# EAGLE board CrowPanel Pico Display-3.5_V1.0-240412 (EAGLE 9.6.2)
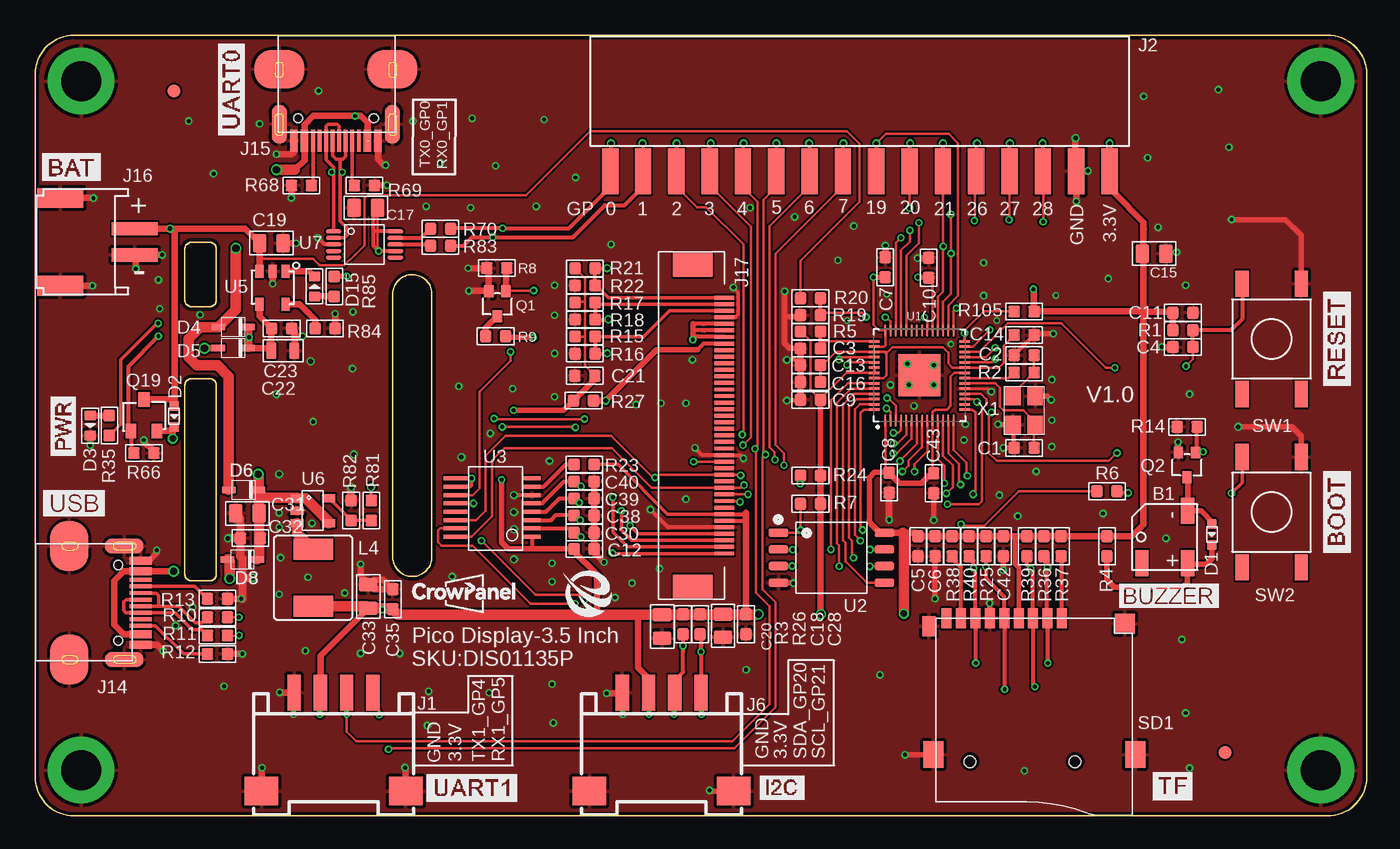
[diagram p5: board, top side]
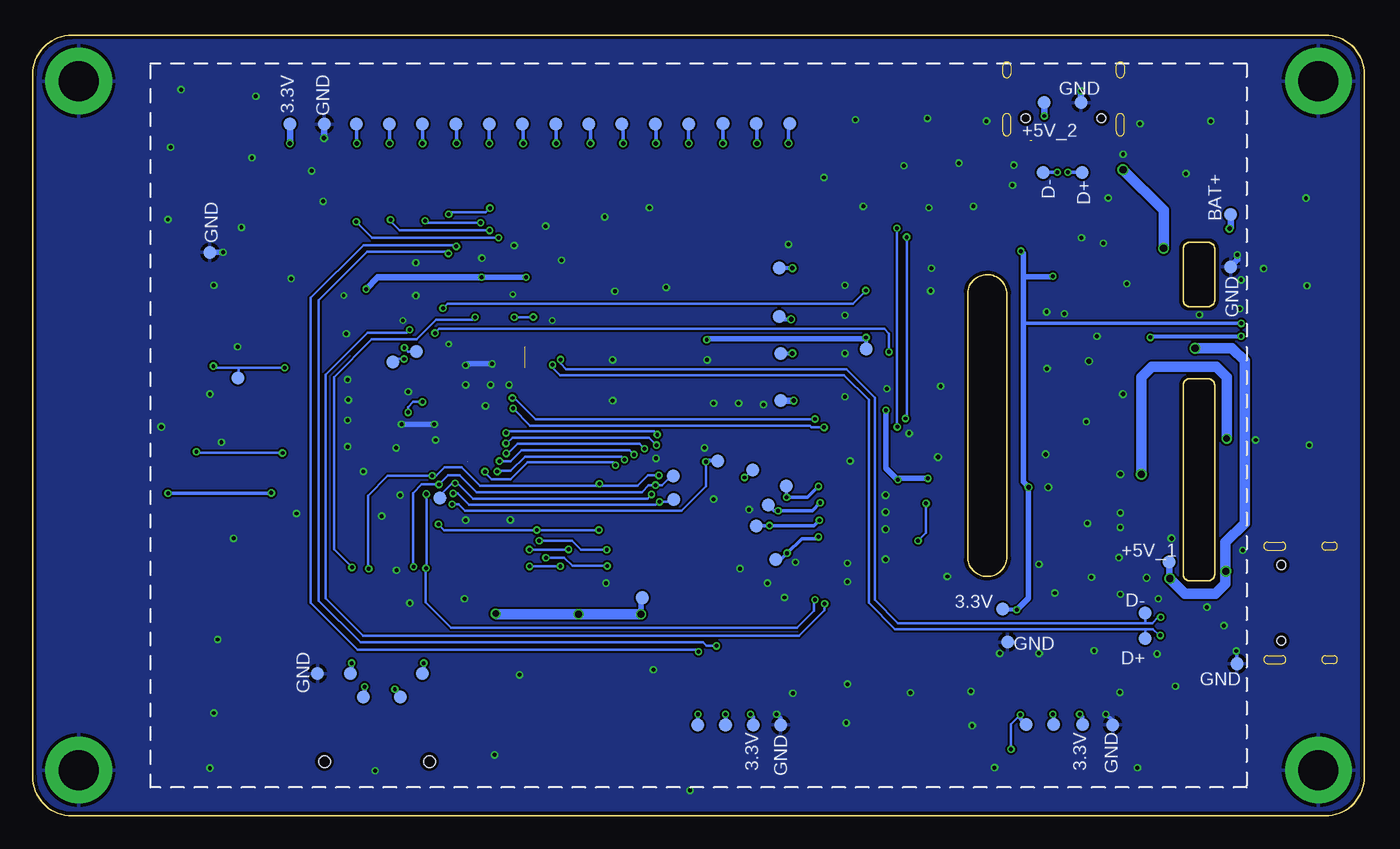
[diagram p6: board, bottom side, seen from below]

Size 101.5 x 59.5 mm. Coordinates in mm from the lower left corner, seen from the top.
Outline: 3,0 98.5,0 arc90 101.5,3 101.5,56.5 arc90 98.5,59.5 3,59.5 arc90 0,56.5 0,3 arc90 3,0
Outline: 11.41,43.21 11.41,39.31 arc90 11.91,38.81 13.31,38.81 arc90 13.81,39.31 13.81,43.21 arc90 13.31,43.71 11.91,43.71 arc90 11.41,43.21
Outline: 11.41,32.82 11.41,18.42 arc90 11.91,17.92 13.31,17.92 arc90 13.81,18.42 13.81,32.82 arc90 13.31,33.32 11.91,33.32 arc90 11.41,32.82
Outline: 27.25,19.75 27.25,39.75 arc-170 30.23,40 30.23,19.5 arc-170 27.25,19.75
Copper layers (1*16): Top 0.035mm / dielectric 1.5mm / Bottom 0.035mm
Design rules "default *": minimum track width 0.2mm, minimum drill 0.3mm, track to track 6mil, track to pad 6mil, pad to pad 6mil, via to via 6mil, smd to smd 6mil, copper to edge 10mil, drill to drill 6mil, minimum pad ring 5mil, minimum via ring 5mil, stop-mask expansion 4mil, vias tented up to drill 100mil, thermal gap 10mil
Net classes: 1 PWR: width 0.254 mm; 2 GND: width 0.203 mm; 3 RS485: width 0.203 mm, clearance 0.203 mm; 4 USB: width 0.203 mm, clearance 0.152 mm; 5 ANT: width 0.889 mm, clearance 0.203 mm

## Footprints (pad centres in the part's own frame; a part is rotated, then mirrored left to right if it is on the bottom)
BEEP_5025 = smd 2 x 1: 1 -2,-1.75; 2 2,-1.75; 3 -2,1.75
A_XBJ_0603 = smd 0.889 x 0.889: 1 -0.762,0; 2 0.762,0
A_XBJ_0805 = smd 1.016 x 1.397: 1 -0.889,0; 2 0.889,0
DISCRETE_C0603 = smd 0.889 x 0.889: 1 -0.762,0; 2 0.762,0
0805_S = smd 0.762 x 1.27: 1 -0.889,0; 2 0.889,0
C0603 = smd 0.889 x 0.889: 1 -0.762,0; 2 0.762,0
0603 = smd 0.889 x 0.889: 1 -0.762,0; 2 0.762,0
SOD-523 = smd 0.762 x 0.7: + -0.8,0; - 0.8,0
DISCRETE_D0603 = smd 0.762 x 0.889: + -0.762,0; - 0.762,0
SOD-323 = smd 1.016 x 0.508: 1 1.137,0; 2 -1.137,0
CONNECTOR_4P-SMD-2.0-90D = smd 1.01 x 2.74: 1 -3,-0.1; 2 -1,-0.1; 3 1,-0.1; 4 3,-0.1 | smd 2.54 x 2.184: SS1 -5.5,7.4; SS2 5.5,7.4
2.54-16P-WOTIE = smd 1.25 x 3.5: 1 -18.999,-5.572; 2 -16.51,-5.572; 3 -13.97,-5.572; 4 -11.43,-5.572; 5 -8.89,-5.572; 6 -6.35,-5.572; 7 -3.81,-5.572; 8 -1.27,-5.572; 9 1.27,-5.572; 10 3.81,-5.572; 11 6.35,-5.572; 12 8.89,-5.572; 13 11.43,-5.572; 14 13.97,-5.572; 15 16.51,-5.572; 16 19.05,-5.572
KEVIN_3.0TYPEC-SMD = smd 0.3 x 1.7: A1 -3.35,0.5; A4 -2.55,0.5; A5 -1.25,0.5; A6 -0.25,0.5; A7 0.25,0.5; A8 1.25,0.5; A9 2.55,0.5; A12 3.35,0.5; B1 3.05,0.5; B4 2.25,0.5; B5 1.75,0.5; B6 0.75,0.5; B7 -0.75,0.5; B8 -1.75,0.5; B9 -2.25,0.5; B12 -3.05,0.5 | smd 1.143 x 2.921: P$6 -4.318,-0.762; P$7 4.318,-0.762 | smd 3.81 x 2.921: P$8 -4.318,-4.953; P$9 4.318,-4.953 | hole 0.68: -2.89,-1.22; 2.89,-1.22
PH2.0WT-2PIN = smd 1 x 3.5: P$1 -1,0; P$2 1,0 | smd 1.5 x 3.5: P$3 -3.35,-5.7; P$4 3.35,-5.7
40PIN-0.5MM = smd 0.3 x 1.5: 1 9.42,1.73; 2 8.92,1.73; 3 8.42,1.73; 4 7.92,1.73; 5 7.42,1.73; 6 6.92,1.73; 7 6.42,1.73; 8 5.92,1.73; 9 5.42,1.73; 10 4.92,1.73; 11 4.42,1.73; 12 3.92,1.73; 13 3.42,1.73; 14 2.92,1.73; 15 2.42,1.73; 16 1.92,1.73; 17 1.42,1.73; 18 0.92,1.73; 19 0.42,1.73; 20 -0.08,1.73; 21 -0.58,1.73; 22 -1.08,1.73; 23 -1.58,1.73; 24 -2.08,1.73; 25 -2.58,1.73; 26 -3.08,1.73; 27 -3.58,1.73; 28 -4.08,1.73; 29 -4.58,1.73; 30 -5.08,1.73; 31 -5.58,1.73; 32 -6.08,1.73; 33 -6.58,1.73; 34 -7.08,1.73; 35 -7.58,1.73; 36 -8.08,1.73; 37 -8.58,1.73; 38 -9.08,1.73; 39 -9.58,1.73; 40 -10.08,1.73 | smd 1.8 x 3: P$41 -12.58,-0.67; P$42 11.92,-0.67
CD54_CD54 = smd 3 x 1.6: 1 0,2.159; 2 0,-2.159
CROWPI_POW_PAD-1.0MM = smd 1 x 1: P$1 0,0
PAD-1.0MM = smd 1 x 1: P$1 0,0
SOT-323_W = smd 0.7 x 0.9: 1 -0.65,-0.95; 2 0.65,-0.95; 3 0,0.95
SOT-23 = smd 1.1 x 0.8: 1 1.2,-1; 2 1.2,1 | smd 1.1 x 0.9: 3 -1.2,0
DISCRETE_R0603 = smd 0.889 x 0.889: 1 -0.762,0; 2 0.762,0
9P-SMD-W/-RING = smd 1.524 x 0.762: 1 0,4.4; 2 0,3.3; 3 0,2.2; 4 0,1.1; 5 0,0; 6 0,-1.1; 7 0,-2.2; 8 0,-3.3; 9 0,-4.4 | smd 1.524 x 1.016: G1 0.6,-5.746 | smd 2.032 x 1.524: G2 10.373,-5.4; G3 10.373,10 | smd 1.524 x 1.524: G4 0.392,9.181 | hole 0.889: 10.9,-2.6; 10.9,5.4
KEY-6 = smd 2 x 1: 1 -4.2,2.25; 2 -4.2,-2.25; 3 4.2,-2.25; 4 4.2,2.25
3M-5 = drill 3.048 pad 5.08: 1 0,0
RP2040_QFN-56 = smd 0.875 x 0.2: 1 -3.437,2.6; 2 -3.437,2.2; 3 -3.437,1.8; 4 -3.437,1.4; 5 -3.437,1; 6 -3.437,0.6; 7 -3.437,0.2; 8 -3.437,-0.2; 9 -3.437,-0.6; 10 -3.437,-1; 11 -3.437,-1.4; 12 -3.437,-1.8; 13 -3.437,-2.2; 14 -3.437,-2.6; 29 3.437,-2.6; 30 3.437,-2.2; 31 3.437,-1.8; 32 3.437,-1.4; 33 3.437,-1; 34 3.437,-0.6; 35 3.437,-0.2; 36 3.437,0.2; 37 3.437,0.6; 38 3.437,1; 39 3.437,1.4; 40 3.437,1.8; 41 3.437,2.2; 42 3.437,2.6 | smd 0.2 x 0.875: 15 -2.6,-3.437; 16 -2.2,-3.437; 17 -1.8,-3.437; 18 -1.4,-3.437; 19 -1,-3.437; 20 -0.6,-3.437; 21 -0.2,-3.437; 22 0.2,-3.437; 23 0.6,-3.437; 24 1,-3.437; 25 1.4,-3.437; 26 1.8,-3.437; 27 2.2,-3.437; 28 2.6,-3.437; 43 2.6,3.437; 44 2.2,3.437; 45 1.8,3.437; 46 1.4,3.437; 47 1,3.437; 48 0.6,3.437; 49 0.2,3.437; 50 -0.2,3.437; 51 -0.6,3.437; 52 -1,3.437; 53 -1.4,3.437; 54 -1.8,3.437; 55 -2.2,3.437; 56 -2.6,3.437 | smd 3.2 x 3.2: EPAD 0,0
SELF_SOIC-8-208MIL = smd 1.5 x 0.635: 1 -4.05,1.905; 2 -4.05,0.635; 3 -4.05,-0.635; 4 -4.05,-1.905; 5 4.05,-1.905; 6 4.05,-0.635; 7 4.05,0.635; 8 4.05,1.905
XP2046-SSOP16 = smd 0.305 x 1.27: 1 -2.54,-2.54; 2 -1.905,-2.54; 3 -1.27,-2.54; 4 -0.635,-2.54; 5 0,-2.54; 6 0.635,-2.54; 7 1.27,-2.54; 8 1.905,-2.54 | smd 0.305 x 1.778: 9 1.905,3.302; 10 1.27,3.302; 11 0.635,3.302; 12 0,3.302; 13 -0.635,3.302; 14 -1.27,3.302; 15 -1.905,3.302; 16 -2.54,3.302
SOP23-5 = smd 1 x 0.635: 1 -1.27,1; 2 -1.27,0; 3 -1.27,-1; 4 1.27,-1; 5 1.27,1
CROWBOT_-V1.0-20220525_A_XBJ_SOT23-5 = smd 0.6 x 1: 1 -0.95,-1.2; 2 0,-1.2; 3 0.95,-1.2; 4 0.95,1.2; 5 -0.95,1.2
MSOP-10_W = smd 1.2 x 0.3: 1 -2.35,1; 2 -2.35,0.5; 3 -2.35,0; 4 -2.35,-0.5; 5 -2.35,-1; 6 2.35,-1; 7 2.35,-0.5; 8 2.35,0; 9 2.35,0.5; 10 2.35,1
A_XBJ_SMD3225 = smd 1.4 x 1.2: 1 -1.1,-0.85; 2 1.1,-0.85; 3 1.1,0.85; 4 -1.1,0.85

## Placement (x,y rotation side)
B1  BEEP_5025  [BEEP_5025]  86.1,21.25 90 top
C1  12PF  [A_XBJ_0603]  75.38,28.05 180 top
C2  12PF  [A_XBJ_0603]  75.38,35.11 0 top
C3  2.2UF  [A_XBJ_0603]  59.1,35.63 180 top
C4  100NF  [A_XBJ_0603]  87.48,35.73 180 top
C5  100NF  [A_XBJ_0603]  67.3,20.55 270 top
C6  2.2UF  [A_XBJ_0603]  68.6,20.55 270 top
C7  100NF  [A_XBJ_0603]  64.8,41.81 90 top
C8  100NF  [A_XBJ_0603]  65.1,25.4 270 top
C9  100NF  [A_XBJ_0603]  59.1,31.71 180 top
C10  100NF  [A_XBJ_0603]  68.12,41.77 90 top
C11  100NF  [A_XBJ_0603]  87.48,38.35 0 top
C12  100NF  [A_XBJ_0603]  41.85,20.35 0 top
C13  100NF  [A_XBJ_0603]  59.1,34.36 180 top
C14  100NF  [A_XBJ_0603]  75.38,36.65 0 top
C15  47UF  [A_XBJ_0805]  85.3,42.85 180 top
C16  2.2UF  [A_XBJ_0603]  59.1,33.06 180 top
C17  47UF  [A_XBJ_0805]  25.2,46.35 180 top
C18  22UF  [A_XBJ_0805]  52.43,14.5 90 top
C19  22UF  [A_XBJ_0805]  18,43.65 180 top
C20  47UF  [A_XBJ_0805]  47.8,14.45 270 top
C21  1uF  [DISCRETE_C0603]  41.9,33.55 0 top
C22  22uF  [0805_S]  18.89,35.45 180 top
C23  100nF  [C0603]  18.79,37.15 0 top
C28  1uF  [DISCRETE_C0603]  54.19,14.61 90 top
C30  100pF  [0603]  41.85,21.59 180 top
C31  22UF  [A_XBJ_0805]  16.18,23.06 0 top
C32  100nF  [A_XBJ_0603]  16.41,21.17 180 top
C33  22UF  [A_XBJ_0805]  25.39,16.72 270 top
C35  100NF  [A_XBJ_0603]  27.26,16.52 90 top
C38  100pF  [0603]  41.85,22.89 180 top
C39  100pF  [0603]  41.85,24.19 180 top
C40  100pF  [0603]  41.85,25.49 180 top
C42  1uF  [DISCRETE_C0603]  73.8,20.55 90 top
C43  100nF  [C0603]  68.5,25.35 270 top
D1  B5819WT  [SOD-523]  89.7,21.45 270 top
D2  B5819WT  [SOD-523]  10.6,30.45 270 top
D3  [DISCRETE_D0603]  4.2,29.75 270 top
D4  SOD-323  [SOD-323]  15.1,37.25 180 top
D5  SOD-323  [SOD-323]  15.1,35.65 180 top
D6  SOD-323  [SOD-323]  15.8,19.55 180 top
D8  SOD-323  [SOD-323]  15.9,24.85 180 top
D15  [DISCRETE_D0603]  21.3,40.35 90 top
J1  [CONNECTOR_4P-SMD-2.0-90D]  22.75,9.3 180 top
J2  2.54-16PIN-WOTIE  [2.54-16P-WOTIE]  62.85,54.7 0 top
J6  [CONNECTOR_4P-SMD-2.0-90D]  47.75,9.3 180 top
J14  USB_TYPE-C_16PIN3.0USB  [KEVIN_3.0TYPEC-SMD]  7.55,16.24 270 top
J15  USB_TYPE-C_16PIN3.0USB  [KEVIN_3.0TYPEC-SMD]  22.93,51.95 180 top
J16  PH2.0WT-2PIN  [PH2.0WT-2PIN]  7.6,43.75 270 top
J17  LXGD-352326-E-Q2  [40PIN-0.5MM]  50.8,29.42 270 top
L4  5.6uH-0530  [CD54_CD54]  21.2,18.15 0 top
P1  CROWPI_POW_PADPAD-1.0MM  [CROWPI_POW_PAD-1.0MM]  9.71,11.6 0 bottom
P2  CROWPI_POW_PADPAD-1.0MM  [CROWPI_POW_PAD-1.0MM]  14.88,19.37 0 bottom
P3  CROWPI_POW_PADPAD-1.0MM  [CROWPI_POW_PAD-1.0MM]  16.7,13.54 0 bottom
P4  CROWPI_POW_PADPAD-1.0MM  [CROWPI_POW_PAD-1.0MM]  16.7,15.45 0 bottom
P5  CROWPI_POW_PADPAD-1.0MM  [CROWPI_POW_PAD-1.0MM]  49.3,27.05 0 bottom
P6  CROWPI_POW_PADPAD-1.0MM  [CROWPI_POW_PAD-1.0MM]  10.2,41.85 0 bottom
P7  CROWPI_POW_PADPAD-1.0MM  [CROWPI_POW_PAD-1.0MM]  10.2,45.85 0 bottom
P8  CROWPI_POW_PADPAD-1.0MM  [CROWPI_POW_PAD-1.0MM]  43.81,52.76 0 bottom
P9  CROWPI_POW_PADPAD-1.0MM  [CROWPI_POW_PAD-1.0MM]  79.8,10.85 0 bottom
P10  CROWPI_POW_PADPAD-1.0MM  [CROWPI_POW_PAD-1.0MM]  21.48,6.96 0 bottom
P11  CROWPI_POW_PADPAD-1.0MM  [CROWPI_POW_PAD-1.0MM]  74.06,34.58 0 bottom
P12  CROWPI_POW_PADPAD-1.0MM  [CROWPI_POW_PAD-1.0MM]  72.26,35.39 0 bottom
P13  CROWPI_POW_PADPAD-1.0MM  [CROWPI_POW_PAD-1.0MM]  55.03,16.63 0 bottom
P14  CROWPI_POW_PADPAD-1.0MM  [CROWPI_POW_PAD-1.0MM]  19.19,6.94 0 bottom
P15  CROWPI_POW_PADPAD-1.0MM  [CROWPI_POW_PAD-1.0MM]  48.7,6.95 0 bottom
P16  CROWPI_POW_PADPAD-1.0MM  [CROWPI_POW_PAD-1.0MM]  50.8,6.95 0 bottom
P17  CROWPI_POW_PADPAD-1.0MM  [CROWPI_POW_PAD-1.0MM]  46.35,52.75 0 bottom
P18  CROWPI_POW_PADPAD-1.0MM  [CROWPI_POW_PAD-1.0MM]  48.89,52.75 0 bottom
P19  CROWPI_POW_PADPAD-1.0MM  [CROWPI_POW_PAD-1.0MM]  51.51,52.71 0 bottom
P20  CROWPI_POW_PADPAD-1.0MM  [CROWPI_POW_PAD-1.0MM]  54.05,52.71 0 bottom
P21  CROWPI_POW_PADPAD-1.0MM  [CROWPI_POW_PAD-1.0MM]  44.5,6.95 0 bottom
P22  CROWPI_POW_PADPAD-1.0MM  [CROWPI_POW_PAD-1.0MM]  46.6,6.95 0 bottom
P23  CROWPI_POW_PADPAD-1.0MM  [CROWPI_POW_PAD-1.0MM]  23.68,6.96 0 bottom
P24  CROWPI_POW_PADPAD-1.0MM  [CROWPI_POW_PAD-1.0MM]  25.78,6.96 0 bottom
P25  CROWPI_POW_PADPAD-1.0MM  [CROWPI_POW_PAD-1.0MM]  21.6,54.35 0 bottom
P26  CROWPI_POW_PADPAD-1.0MM  [CROWPI_POW_PAD-1.0MM]  24.4,54.35 0 bottom
P27  CROWPI_POW_PADPAD-1.0MM  [CROWPI_POW_PAD-1.0MM]  21.5,49.05 0 bottom
P28  CROWPI_POW_PADPAD-1.0MM  [CROWPI_POW_PAD-1.0MM]  24.5,49.05 0 bottom
P29  CROWPI_POW_PADPAD-1.0MM  [CROWPI_POW_PAD-1.0MM]  27.2,13.25 0 bottom
P30  CROWPI_POW_PADPAD-1.0MM  [CROWPI_POW_PAD-1.0MM]  81.9,52.71 0 bottom
P31  CROWPI_POW_PADPAD-1.0MM  [CROWPI_POW_PAD-1.0MM]  85.85,33.39 0 bottom
P32  CROWPI_POW_PADPAD-1.0MM  [CROWPI_POW_PAD-1.0MM]  52.69,25.9 0 bottom
P33  CROWPI_POW_PADPAD-1.0MM  [CROWPI_POW_PAD-1.0MM]  44.86,19.53 0 bottom
P34  CROWPI_POW_PADPAD-1.0MM  [CROWPI_POW_PAD-1.0MM]  70.47,24.23 0 bottom
P35  CROWPI_POW_PADPAD-1.0MM  [CROWPI_POW_PAD-1.0MM]  52.65,24.1 0 bottom
P36  CROWPI_POW_PADPAD-1.0MM  [CROWPI_POW_PAD-1.0MM]  76.3,9.05 0 bottom
P37  CROWPI_POW_PADPAD-1.0MM  [CROWPI_POW_PAD-1.0MM]  44.06,25.14 0 bottom
P38  CROWPI_POW_PADPAD-1.0MM  [CROWPI_POW_PAD-1.0MM]  45.44,23.69 0 bottom
P39  CROWPI_POW_PADPAD-1.0MM  [CROWPI_POW_PAD-1.0MM]  46.34,22.11 0 bottom
P40  CROWPI_POW_PADPAD-1.0MM  [CROWPI_POW_PAD-1.0MM]  44.5,31.65 0 bottom
P41  CROWPI_POW_PADPAD-1.0MM  [CROWPI_POW_PAD-1.0MM]  37.99,35.6 0 bottom
P42  CROWPI_POW_PADPAD-1.0MM  [CROWPI_POW_PAD-1.0MM]  88,42.95 0 bottom
P43  CROWPI_POW_PADPAD-1.0MM  [CROWPI_POW_PAD-1.0MM]  27.57,15.76 0 bottom
P44  CROWPI_POW_PADPAD-1.0MM  [CROWPI_POW_PAD-1.0MM]  46.64,26.35 0 bottom
P45  CROWPI_POW_PADPAD-1.0MM  [CROWPI_POW_PAD-1.0MM]  73.5,9.05 0 bottom
P46  CROWPI_POW_PADPAD-1.0MM  [CROWPI_POW_PAD-1.0MM]  71.8,10.85 0 bottom
P47  CROWPI_POW_PADPAD-1.0MM  [CROWPI_POW_PAD-1.0MM]  77.3,10.85 0 bottom
P48  PADPAD-1.0MM  [PAD-1.0MM]  90.7,4.85 0 top
P49  PADPAD-1.0MM  [PAD-1.0MM]  10.6,55.25 0 top
P50  CROWPI_POW_PADPAD-1.0MM  [CROWPI_POW_PAD-1.0MM]  56.59,52.71 0 bottom
P51  CROWPI_POW_PADPAD-1.0MM  [CROWPI_POW_PAD-1.0MM]  59.11,52.71 0 bottom
P52  CROWPI_POW_PADPAD-1.0MM  [CROWPI_POW_PAD-1.0MM]  61.65,52.71 0 bottom
P53  CROWPI_POW_PADPAD-1.0MM  [CROWPI_POW_PAD-1.0MM]  64.19,52.71 0 bottom
P54  CROWPI_POW_PADPAD-1.0MM  [CROWPI_POW_PAD-1.0MM]  66.71,52.71 0 bottom
P55  CROWPI_POW_PADPAD-1.0MM  [CROWPI_POW_PAD-1.0MM]  69.25,52.71 0 bottom
P56  CROWPI_POW_PADPAD-1.0MM  [CROWPI_POW_PAD-1.0MM]  71.79,52.71 0 bottom
P57  CROWPI_POW_PADPAD-1.0MM  [CROWPI_POW_PAD-1.0MM]  74.31,52.71 0 bottom
P58  CROWPI_POW_PADPAD-1.0MM  [CROWPI_POW_PAD-1.0MM]  76.85,52.71 0 bottom
P59  CROWPI_POW_PADPAD-1.0MM  [CROWPI_POW_PAD-1.0MM]  79.29,52.71 0 bottom
P60  CROWPI_POW_PADPAD-1.0MM  [CROWPI_POW_PAD-1.0MM]  44.5,35.25 0 bottom
P61  CROWPI_POW_PADPAD-1.0MM  [CROWPI_POW_PAD-1.0MM]  44.6,38.05 0 bottom
P62  CROWPI_POW_PADPAD-1.0MM  [CROWPI_POW_PAD-1.0MM]  44.6,41.75 0 bottom
Q1  HXY2102EI  [SOT-323_W]  35.23,39.03 180 top
Q2  HXY2102EI  [SOT-323_W]  87.8,26.75 180 top
Q19  PMOS-3401-4A  [SOT-23]  8.3,30.55 270 top
R1  10K  [DISCRETE_R0603]  87.48,37.01 180 top
R2  1K  [DISCRETE_R0603]  75.38,33.79 180 top
R3  4.7K  [DISCRETE_R0603]  49.39,14.61 90 top
R4  3R  [DISCRETE_R0603]  81.7,20.55 90 top
R5  0R  [DISCRETE_R0603]  59.1,36.91 180 top
R6  1K  [DISCRETE_R0603]  81.7,24.75 0 top
R7  10K  [DISCRETE_R0603]  59.1,23.8 0 top
R8  10K/NC  [DISCRETE_R0603]  35.2,41.75 0 top
R9  0R 5%  [DISCRETE_R0603]  35.1,36.55 0 top
R10  22R  [DISCRETE_R0603]  13.9,15.15 0 top
R11  22R  [DISCRETE_R0603]  13.9,13.75 0 top
R12  5.1K  [DISCRETE_R0603]  13.9,12.35 0 top
R13  5.1K  [DISCRETE_R0603]  13.9,16.55 180 top
R14  10K/NC  [DISCRETE_R0603]  87.8,29.65 0 top
R15  10K  [DISCRETE_R0603]  41.91,36.53 180 top
R16  NC  [DISCRETE_R0603]  41.91,35.23 0 top
R17  10K  [DISCRETE_R0603]  41.91,39.13 180 top
R18  NC  [DISCRETE_R0603]  41.91,37.83 0 top
R19  100K1%  [DISCRETE_R0603]  59.1,38.15 180 top
R20  100K1%  [DISCRETE_R0603]  59.1,39.45 0 top
R21  10K  [DISCRETE_R0603]  41.91,41.73 180 top
R22  NC  [DISCRETE_R0603]  41.91,40.43 0 top
R23  10K/NC  [DISCRETE_R0603]  41.85,26.79 180 top
R24  1K  [DISCRETE_R0603]  59.1,25.95 0 top
R25  1K  [DISCRETE_R0603]  72.5,20.55 90 top
R26  4.7K  [DISCRETE_R0603]  50.69,14.61 90 top
R27  3R  [DISCRETE_R0603]  41.8,31.65 180 top
R35  4.7K  [DISCRETE_R0603]  5.66,29.75 270 top
R36  10K  [DISCRETE_R0603]  76.9,20.55 270 top
R37  10K  [DISCRETE_R0603]  78.2,20.55 270 top
R38  10K  [DISCRETE_R0603]  69.9,20.55 270 top
R39  10K  [DISCRETE_R0603]  75.6,20.55 270 top
R40  10K  [DISCRETE_R0603]  71.2,20.55 270 top
R66  10K  [DISCRETE_R0603]  8.3,27.65 180 top
R68  5.1K  [DISCRETE_R0603]  20.3,48.05 180 top
R69  5.1K  [DISCRETE_R0603]  25.1,48.05 180 top
R70  0R  [DISCRETE_R0603]  30.9,44.75 0 top
R81  45.3K 1%  [DISCRETE_R0603]  25.63,23.28 270 top
R82  10K 1%  [DISCRETE_R0603]  24.09,23.28 270 top
R83  0R  [DISCRETE_R0603]  30.9,43.45 0 top
R84  2K  [DISCRETE_R0603]  22.1,37.15 0 top
R85  4.7K  [DISCRETE_R0603]  22.8,40.35 90 top
R105  10K  [DISCRETE_R0603]  75.38,38.45 0 top
SD1  [9P-SMD-W/-RING]  73.87,15.05 270 top
SW1  KEY-6  [KEY-6]  94.25,36.35 270 top
SW2  KEY-6  [KEY-6]  94.25,23.15 270 top
T1  3M-5  [3M-5]  3.5,56 0 top
T2  3M-5  [3M-5]  3.5,3.5 0 top
T3  3M-5  [3M-5]  98,3.5 0 top
T4  3M-5  [3M-5]  98,56 0 top
U1  RP2040_RP2040  [RP2040_QFN-56]  67.41,33.57 90 top
U2  SELF_W25Q128JV  [SELF_SOIC-8-208MIL]  60.7,19.68 0 top
U3  XPT2046  [XP2046-SSOP16]  35.34,23.82 90 top
U5  4054A  [SOP23-5]  18.1,40.25 270 top
U6  HM3416H  [CROWBOT_-V1.0-20220525_A_XBJ_SOT23-5]  21.17,23.27 270 top
U7  CH340X  [MSOP-10_W]  25.1,43.55 0 top
X1  12MHZ_SMD3225  [A_XBJ_SMD3225]  75.38,30.9 90 top

## Tracks (layer width: path | path; a pad name or v marks a point on that pad's centre or on a via)
+1V1
  Top 0.2: C16.1 59.74,33.06 59.86,33.18 C13.1 60.03,34.36 61.04,35.37 U1.45 64.76,35.37 64.83,35.3 64.88,35.35 64.88,35.25 | U1.50 64.67,33.37 64.88,33.58 64.88,35.25 | C14.1 73.83,35.85 73.83,34.55 73.45,34.17 U1.23 69.93,34.17 69.6,34.5 69.6,35.3 69.19,35.71 65.34,35.71 64.88,35.25
+3V3  (via drill 0.3, 0.35, 0.5)  (1 unrouted)
  Top 0.2: 64.82,37 U1.42 64.33,37.01 63.92,37.42 63.92,41.05 C7.1 | 61.85,33.77 59.86,31.78 C9.1 59.1,32.47 59.1,36.22 58.41,36.91 R5.2 | U1.33 68.41,41 68.41,41.3 C10.1 | U1.1 64.81,26.45 65.09,26.18 C8.1 | R21.2 41.91,40.97 41.91,39.17 | 41.91,36.49 41.91,39.17 | R17.2 41.19,39.17 41.91,39.17 | R15.2 41.87,36.53 41.91,36.49 | U1.10 68.41,26.2 C43.1 | U1.49 U1.48 | C21.2 42.63,33.58 41.91,34.31 41.91,36.49
  Top 0.203: U1.10 68.41,30.77 68.61,30.97 69.49,30.97 69.77,31.25 69.77,33.48 70.06,33.77 U1.22 | U1.42 64.81,35.86 64.7,35.75 63.99,35.75 U1.44 | U1.49 61.85,33.77 | C15.2 84.49,42.85 | v55.14,15.37 54.33,15.37 54.3,15.34 | C17.1 26.09,43.26 26.3,43.05 | C20.1 49.3,15.34
  Top 0.254: J17.7 48.21,23 44.42,26.79 R23.1 | v33.27,25.72 U3.9 | U3.10 33.14,25.09 33.27,25.22 v33.27,25.72 | U3.9 v33.27,25.73 v33.27,25.72 | R35.2 6.51,29.84 6.51,34.75 9.29,37.53 v9.39,37.53 | R81.1 25.63,25.02 v25.6,25.05 | 74.4,21.31 73.5,21.31 | 74.8,21.31 74.69,21.31
  Top 0.3: U7.10 25.82,44.55 | 25.82,44.55 25.82,46.51 | U7.7 26.3,43.05 v26.18,43.05 25.82,43.4 25.82,44.55 | J17.7 54.1,23 54.19,23.09 | J17.6 54.13,22.5 54.19,22.44 | J6.3 46.75,7.8 v46.8,7.75 | v21.7,7.75 21.7,8.75 21.8,8.85 21.8,9.35 J1.3
  Top 0.305: C12.1 37.88,20.35 U3.1
  Top 0.35: SD1.4 74.97,18.93 74.69,19.21 74.69,21.31
  Top 0.406: C43.1 68.3,26.11 67.56,25.37 65.89,25.37 C8.1 | U2.8 64.39,21.59 63.59,22.39 63.59,25.78 63.99,26.18 65.09,26.18 | R24.2 59.86,31.78 | 59.86,31.78 | C12.1 36.06,20.35 35.56,20.85 v35.56,25.62 | v23.75,41.13 23.73,41.11 R85.2 | C7.1 v63.9,41.05 | v67.3,41.05 68.36,41.05 68.41,41 | v36.47,30.91 40.3,30.91 R27.2 42.63,33.24 42.63,33.58
  Top 0.508: C33.2 25.31,15.75 | J1.3 21.75,12.21 25.3,15.76 C35.1 | 74.69,21.31 74.4,21.31 C42.2 73.5,21.31 R25.2 R40.1 R38.1 C6.1 C5.1 67.03,21.59 66.13,21.59 U2.8 | 74.8,21.31 R39.1 R36.1 R37.1 R4.2 83.61,21.31 84.49,22.19 84.49,38.44 | R3.2 R26.2 50.71,15.39 C18.2 52.45,15.37 C28.2 | R1.2 C11.1 86.63,38.44 84.7,38.44 84.69,38.45 R105.2 76.14,40.11 v76.1,40.15 | C35.1 | 42.82,15.37 45.95,15.37 45.95,11.3 46.75,10.5 J6.3 | C12.1 41.09,20.15 42.82,18.42 42.82,15.37 | 42.82,15.37 27.65,15.37 C35.1 | 54.19,23.09 54.19,22.44 C28.2 | C28.2 v55.14,15.37 | C35.1 27.21,15.71 v26.5,15.71 | 84.49,44.69 84.5,44.7 | 84.49,38.44 84.49,42.85 84.49,44.69 | 84.5,38.44 84.49,38.44 | 84.49,44.69 84.49,45.24 82.17,47.56 82.17,48.86 J2.16 v81.9,51.25 | v59.9,15.37 59.86,15.41 R7.2 R24.2
  Top 0.813: L4.2 25.23,15.99 C33.2 27.19,15.83 C35.1 27.67,15.34 49.3,15.34 54.3,15.34 54.98,15.34 55,15.33 | 66.13,21.59 66.21,21.51 v66.21,15.42
  Bottom 0.254: 26,37.53 v9.39,37.53
  Bottom 0.3: v46.8,7.75 46.6,7.55 P22.P$1 | P10.P$1 21.48,7.53 v21.7,7.75 | P43.P$1 26.55,15.76 v26.5,15.71 | 54.95,16.55 P13.P$1
  Bottom 0.406: v33.27,25.72 35.46,25.72 v35.56,25.62 35.58,25.62 36.47,26.51 v36.47,30.91 | 26,41.1 23.78,41.1 v23.75,41.13 | 26,41.1 26,42.87 v26.18,43.05 | v63.9,41.05 v67.3,41.05 | 26,41.1 26,37.53 26,25.45 v25.6,25.05 25.6,16.61 v26.5,15.71 | P13.P$1 55.14,16.52 v55.14,15.37
  Bottom 0.508: 66.16,15.37 v66.21,15.42 | v67.3,41.05 75.2,41.05 v76.1,40.15 | P30.P$1 v81.9,51.25
  Bottom 0.813: v55.14,15.37 v59.9,15.37 66.16,15.37
+5V_UART0  (via drill 0.3, 0.55)  (1 unrouted)
  Top 0.254: 25.33,51.6 25.33,51.73 | 20.53,51.45 J15.B4 J15.A9 | J15.B9 J15.A4
  Top 0.508: 25.33,51.45 25.33,51.73 25.33,52.82 24.81,53.34 v24.4,53.34 21.18,53.34 20.53,52.69 20.53,51.45 20.53,49.98 19.8,49.25
  Top 0.813: D8.1 14.76,33.49 13.9,34.35 12.3,34.35 11.7,34.95 11.7,36.35 12.6,37.25 D4.1 15.3,38.59 v15.3,43.25 | 19.8,49.25 v18.4,49.25
  Bottom 0.508: P26.P$1 v24.4,53.34
  Bottom 0.813: v15.3,43.25 15.3,46.15 v18.4,49.25
+5V_USB  (via drill 0.55)
  Top 0.254: 8.05,13.84 J14.B4 J14.A9 | J14.B9 J14.A4 8.18,18.66 8.33,18.66
  Top 0.508: D5.1 v12.9,35.65 | 8.05,13.84 6.75,13.84 6.03,14.56 6.03,17.93 6.76,18.66 8.33,18.66 10.55,18.66 v10.57,18.64
  Top 0.813: D6.1 14.82,19.39 v14.82,18.1
  Bottom 0.508: P2.P$1 14.88,18.16 v14.82,18.1
  Bottom 0.813: v12.9,35.65 10.1,35.65 9.13,34.68 9.13,22.32 10.6,20.85 10.6,18.67 v10.57,18.64 10.61,18.61 10.61,17.7 11.35,16.95 13.7,16.95 14.82,18.07 v14.82,18.1
AVDD
  Top 0.2: U1.43 59.86,36.17 R5.1
  Top 0.3: C3.1 R5.1
BAT+  (via drill 0.35)
  Top 0.2: R20.1 58.34,42.3 62.84,46.8 62.84,51.22 61.88,52.18 42.29,52.18 37.42,47.31 25.35,47.31 25.11,47.06 25.11,43.49 24.38,42.77 | 17.1,42.45 20.8,42.45
  Top 0.203: 20.8,42.45 21.2,42.45 21.7,41.95 23.56,41.95 24.38,42.77
  Top 0.508: 10.62,44.75 16.01,44.75 C19.2 17.1,43.64 17.1,42.45 U5.3 | Q19.3 10.6,31.75 D2.+ 10.62,31.27 10.62,44.75 | J16.P$1 v10.29,44.75 10.62,44.75
  Bottom 0.508: P7.P$1 10.2,44.84 v10.29,44.75
BOOT  (via drill 0.3)
  Top 0.254: v83.32,24.62 82.59,24.62 R6.2 | SW2.2 92,25.4 v91.19,24.59
  Bottom 0.254: v91.19,24.59 83.35,24.59 v83.32,24.62
CHG_LED
  Top 0.508: U5.1 20.89,41.52 D15.-
D+
  Top 0.254: R11.1 12.68,14.21 11.96,14.21 10.68,15.49 J14.B6 6.92,15.49 6.75,15.66 6.75,16.31 6.93,16.49 J14.A6
D-
  Top 0.254: R10.1 12.71,14.73 12.2,14.73 10.94,15.99 9.43,15.99 | J14.A7 9.43,15.99 | J14.B7 9.24,16.99 9.43,16.8 9.43,15.99
GND  (via drill 0.25, 0.3, 0.35)
  Top 0.203: J14.A1 J14.B12 8.21,19.45 | U1.19 72.63,32.57 v72.88,32.32 | J15.B12 26.13,51.3
  Top 0.254: 53.36,37.99 53.59,38.23 53.59,39.93 53.24,40.28
  Top 0.3: U7.3 22.07,43.55 v21.56,44.06 | J6.4 44.75,7.8 v44.8,7.75 | v19.7,7.75 19.7,8.65 19.8,8.75 19.8,9.35 J1.4 | J17.5 48.25,22 v46.9,23.35 | v54,27.25 53.75,27.5 J17.16 50.85,27.5 v50.3,28.05
  Top 0.305: C2.1 76.14,36.63 C14.2 | C1.2 74.62,29.71 X1.4 | J14.A12 8.2,13.04 | J15.A12 19.73,51.3 | C13.2 57.95,34.75 v57.3,34.75 | C9.2 58.28,31.65 v57.3,31.65 | 53.36,37.99 J17.37 | v53.22,40.28 53.24,40.28 | U3.6 v36.5,24.45
  Top 0.406: C3.2 57.51,35.63 57.13,36.01 57.13,38.04 | 57.13,38.04 v57.13,39.99 | R19.2 58.23,38.04 57.13,38.04 | C42.1 73.8,18.75 v73.78,18.73 | SD1.6 v72.77,16.21 v72.76,16.22 | U2.4 57.77,17.77 v57.8,17.75 | C43.2 v68.5,22.55 | SD1.G2 66.33,4.68 v66.3,4.65 | J6.SS1 51.45,1.9 v51.4,1.95 | X1.2 | v77.45,31.7 77.15,32 X1.2 | X1.4 73.45,29.8 v73.4,29.85 | C14.2 76.24,36.75 v77.6,36.75 | C1.2 v73.8,28.05 | v66.5,34.45 67.38,33.57 U1.EPAD 67.78,33.57 v68.5,32.85 | 86.95,42.9 v87,42.95 | C6.2 v68.6,16.55 | 96.5,27.1 SW2.1 96.5,28.95 95.8,29.65 v91.7,29.65 | SW1.1 96.5,44.25 95.3,45.45 v91.2,45.45
  Top 0.508: U5.2 v18.1,40.55 | C19.1 v19.89,43.65 | C23.2 19.78,36.92 C22.1 19.78,36.55 v20.38,36.55 | v22.87,38.27 v22.86,38.26 R84.2 | v8.29,28.65 8.29,28.52 9.06,27.75 R66.1 | J16.P$4 v4.37,40.4 | v7.68,41.71 7.68,42.67 J16.P$2 v9.68,42.75 | J16.P$3 4.43,47.1 v4.45,47.08 | C33.1 25.78,18 26.54,18 C35.2 25.85,17.28 24.8,18.33 v24.8,19.19 | 15.49,21.33 C32.2 15.63,21.15 | v33.01,41.73 34.42,41.73 R8.1 34.58,41.61 Q1.2 34.55,40.01 v33.06,40.01 | 8.21,19.45 8.68,19.45 9.27,20.04 v9.27,20.25 | C16.2 C9.2 C13.2 C3.2 | C40.1 C39.1 C38.1 C30.1 C12.2 42.61,20.09 v43.37,19.33 | C8.2 v65.1,22.56 | 8.2,13.04 9.3,13.04 v9.77,12.57 | 19.73,51.3 19.73,50.62 19.53,50.42 v18.39,50.42 | 26.13,51.3 26.13,50.05 26.58,49.6 v26.72,49.6 | R68.2 v19.54,47.1 v19.53,47.09 | R69.1 v26.81,48.05 v26.82,48.06 | R13.1 v15.69,16.55 | v15.69,16.55 15.78,16.55 | v15.69,16.55 v15.7,16.56 | R12.2 v15.8,12.35 | J1.4 18.66,9.4 v18.64,9.42 | J6.4 44.7,9.35 v43.57,9.35 | J1.SS2 17.25,3.64 v17.29,3.68 | J1.SS1 28.25,3.63 v28.19,3.69 | v87.12,28.48 87.12,27.73 Q2.2 | C7.2 v64.8,43.47 | C10.2 68.1,42.51 v67.27,42.51 | C4.2 85.92,35.73 v85.9,35.75 | v80.25,49.15 80.23,49.13 J2.15 | J2.15 v79.36,46.84 v79.37,46.83 | D3.- v4.2,28.26 | J2.15 79.3,49.19 v79.3,51.65
  Top 0.61: R82.1 v24.09,25.04 v24.1,25.05 | C31.1 15.65,22.7 C32.2 14.72,21.17 v14.7,21.15 | 15.63,21.15 15.63,19.81 15.78,19.65 15.78,18.15 | 15.78,18.15 15.78,16.55 | 15.78,18.15 v16.6,18.15
  Bottom 0.254: P1.P$1 9.71,12.51 v9.77,12.57 | v79.29,51.66 v79.3,51.65
  Bottom 0.3: v44.8,7.75 44.5,7.45 P21.P$1 | P14.P$1 19.19,7.24 v19.7,7.75
  Bottom 0.406: v68.5,34.35 68.4,34.45 v66.5,34.45 | v73.4,29.85 v70.9,29.85 | P42.P$1 v87,42.95
  Bottom 0.508: P25.P$1 v21.6,55.25 | P6.P$1 9.68,42.37 v9.68,42.75 | P59.P$1 v79.29,51.66
  other vias: 43.9,43.55 32.3,32.75 36.4,32.55 49.6,31.45 50.1,34.75 21.2,30.05 38.2,46.45 39.6,40.45 88,32.15 76.3,26.25 73.5,24.45 74.9,22.85 81.4,23.05 86.2,21.15 64.4,10.75 54.2,11.15 49.6,24.15 45.5,17.75 31.8,18.25 39.4,10.05 61.2,42.35 62.4,44.95 57.9,45.65 54.5,46.35 12,15.92 10.7,14.51 77.8,39.65 72.3,39.65 72.3,42.15 61.9,37.75 64.9,39.75 69.8,35.95 73.3,37.75 34.7,29.15 12.57,38.2 24.22,38.41 24.19,34.09 65.2,32.85 67,31.25 66.6,32.85 70.8,28.65 18.6,23.09 18.6,21.99 21.1,22.29 18.7,19.69 18.6,16.89 20.8,18.19 23.6,16.99 24.3,27.55 18.6,26.05 18.4,32.15 21,34.65 39.6,35.25 39.6,38.15 36.5,23.15 36.5,21.85 36.5,19.55 32.5,27.35 24.8,12.39 27.8,12.39 20.6,12.59 14.4,9.89 30,9.49 29.9,6.89 39.5,7.09 34.6,9.39 41.2,48.65 38.8,53.05 33.3,53.15 28.8,52.95 30.9,49.75 35.1,49.55 33.2,46.35 29.8,46.45 91,50.95 90.2,55.35 84.5,54.85 84.8,50.15 85.6,44.85 81.8,40.95 87.7,40.45 87.4,13.45 87.7,7.85 88,3.65 75.4,3.45 17.1,52.75 11.7,52.95 13.6,48.95 9.4,40.85 9.5,38.65 47.7,31.45 45.8,31.35 39.6,31.95 39.2,27.05 39.4,19.25 39.4,17.85 44.2,16.65 47.6,18.85 77.5,33.25 77.5,30.15 77.5,28.15
  pour Top: -1,60.75 -1,-1.25 102.5,-1.25 102.5,60.75
  pour Bottom: -0.5,60.25 -0.5,-0.75 102,-0.75 102,60.25
GP0/UART0_TX  (via drill 0.3, 0.35)
  Top 0.2: U1.2 65.21,30.81 64.96,31.06 v64.9,31.06 | v41.18,29.61 41.14,29.65 v35.61,29.65 | 43.38,47.48 43.38,48.66 J2.1 43.85,47.95 43.56,47.66
  Top 0.254: J2.1 43.9,49.18 v43.9,51.25
  Top 0.3: R70.2 31.69,44.78 v35.64,44.78 40.68,44.78 43.38,47.48 43.56,47.66
  Bottom 0.2: v64.9,31.06 63.59,29.75 42.27,29.75 42.13,29.61 v41.18,29.61 | v41.18,29.61 | v35.64,44.78 35.62,44.76 v35.62,29.66 v35.61,29.65
  Bottom 0.254: v43.9,51.25 43.9,52.67 P8.P$1
GP1/UART0_RX  (via drill 0.3, 0.35)
  Top 0.2: U1.3 65.61,31.26 65.02,31.85 v64.94,31.85 | v41.88,30.25 35.03,30.25 v34.99,30.29 | J2.2 46.34,47.95 45.8,47.41
  Top 0.254: J2.2 46.34,51.21 v46.3,51.25
  Top 0.3: R83.2 32.66,43.45 33.32,44.11 v34.89,44.11 41,44.11 43.43,46.54 44.93,46.54 45.8,47.41 46.03,47.64 46.03,49.1
  Bottom 0.2: v64.94,31.85 64.82,31.85 63.19,30.22 41.91,30.22 v41.88,30.25 | v34.89,44.11 34.87,44.09 34.87,30.41 v34.99,30.29
  Bottom 0.254: v46.3,51.25 46.3,52.7 P17.P$1
GP2/I2C1_SDA  (via drill 0.3, 0.35)
  Top 0.2: U1.4 66.01,29.39 65.81,29.19 v65.43,29.19 | v53.9,29.06 54,29.16 54,43.55 51.15,46.4 50.45,46.4 48.77,48.07 48.88,48.18 J2.3
  Top 0.254: J2.3 48.88,51.23 v48.9,51.25
  Bottom 0.2: v65.43,29.19 65.31,29.31 54.15,29.31 v53.9,29.06
  Bottom 0.254: v48.9,51.25 P18.P$1
GP3/I2C1_SCL  (via drill 0.3, 0.35)
  Top 0.2: U1.5 66.41,29.04 65.76,28.39 v65.44,28.39 | v53.96,28.26 54.56,28.86 54.56,44.91 51.42,48.05 J2.4
  Top 0.254: J2.4 51.42,51.17 v51.5,51.25
  Bottom 0.2: v65.44,28.39 65.37,28.39 64.92,28.84 54.54,28.84 v53.96,28.26
  Bottom 0.254: v51.5,51.25 P19.P$1
GP4/UART1_TX  (via drill 0.3, 0.35)
  Top 0.2: U1.6 66.81,28.73 65.71,27.63 v65.41,27.63 | J1.2 v23.75,7.75 23.75,6.41 24.46,5.7 53.17,5.7 55.97,8.5 55.97,15.99 54.96,17 54.96,27.91 v54.88,27.99 55.06,28.17 55.06,46.82 53.96,47.92 J2.5
  Top 0.254: J2.5 53.96,51.21 v54,51.25
  Bottom 0.2: v65.41,27.63 65.27,27.63 64.54,28.36 55.25,28.36 v54.88,27.99
  Bottom 0.254: P20.P$1 54,52.66 v54,51.25
  Bottom 0.3: P23.P$1 23.68,7.68 v23.75,7.75
GP5/UART1_RX  (via drill 0.3, 0.35)
  Top 0.2: U1.7 67.21,28.36 65.93,27.08 v65.93,27.04 | v26.93,5.09 27,5.16 53.32,5.16 56.43,8.27 56.43,16.27 55.44,17.26 55.44,27.3 v55.68,27.54 55.53,27.69 55.53,46.96 56.5,47.93 J2.6 | v26.22,7.71 26.22,8.11 25.75,8.58 J1.1
  Top 0.254: J2.6 v56.5,51.25
  Bottom 0.2: v65.93,27.04 65.08,27.04 64.25,27.87 56.01,27.87 v55.68,27.54 | v26.22,7.71 26.93,7 v26.93,5.09
  Bottom 0.254: P50.P$1 56.5,52.62 v56.5,51.25
  Bottom 0.3: P24.P$1 26.22,7.41 v26.22,7.71
GP6*I2C1_SDA  (via drill 0.3, 0.35)
  Top 0.2: U1.8 67.61,28.09 66.58,27.06 66.58,26.68 66.15,26.25 v66.1,26.25 | v56.4,27.15 56.36,27.19 56.36,27.73 55.99,28.1 55.99,44.94 59.04,47.99 J2.7
  Top 0.254: J2.7 59.04,51.21 v59,51.25
  Bottom 0.2: v66.1,26.25 66.06,26.29 65.08,26.29 63.99,27.38 56.63,27.38 v56.4,27.15
  Bottom 0.254: P51.P$1 59,52.6 v59,51.25
GP7*I2C1_SCL  (via drill 0.3, 0.35)
  Top 0.2: v57.08,26.73 57.08,27.65 56.45,28.28 56.45,42.85 61.58,47.98 J2.8 | v67.04,26.24 67.04,26.81 68.01,27.78 U1.9
  Top 0.254: J2.8 61.58,51.23 v61.6,51.25
  Bottom 0.2: v57.08,26.73 57.29,26.94 63.77,26.94 65.07,25.64 66.52,25.64 67.04,26.16 v67.04,26.24
  Bottom 0.254: P52.P$1 61.6,52.66 v61.6,51.25
GP8/LCD_DC  (via drill 0.3)
  Top 0.2: U1.11 68.81,27.19 69.31,26.69 v69.31,25.36 | J17.10 v54.33,24.5
  Bottom 0.2: v54.33,24.5 54.64,24.19 67.95,24.19 69.12,25.36 v69.31,25.36 69.54,25.36 70.47,24.43 P34.P$1
GP9/LCD_CS/SPI_CS0  (via drill 0.3)
  Top 0.2: U1.12 69.21,27.44 69.94,26.71 69.94,25.05 v69.47,24.58 | v53.73,23.93 53.66,24 J17.9
  Bottom 0.2: v69.47,24.58 69.11,24.58 68.24,23.71 54.02,23.71 53.8,23.93 v53.73,23.93 52.82,23.93 P35.P$1
GP10/SPI_CLK/LCD_CLK/TP_CLK/SD_CLK  (via drill 0.3)
  Top 0.2: U1.13 69.61,27.65 70.43,26.83 70.43,25.37 v70.54,25.26
  Top 0.203: U3.16 33.28,21.28 34.85,22.85 34.85,27.1 35.78,28.03 43.98,28.03 46.98,25.03 52.5,25.03 J17.11 53.81,25 v54.03,25.22
  Top 0.3: SD1.5 73.87,9.68 v73.9,9.65
  Top 0.305: SD1.5 73.87,16.71 72.48,18.1 v72.48,18.99 72.48,19.68 72.5,19.7 R25.1
  Bottom 0.2: v72.48,18.99 72.48,19.19 72.51,19.22 72.51,24.6 71.85,25.26 v70.54,25.26 69.84,25.96 68.97,25.96 67.69,24.68 55.08,24.68 54.55,25.21 | 52.86,25.9 P32.P$1
  Bottom 0.203: 54.55,25.21 54.54,25.22 v54.03,25.22 53.54,25.22 52.86,25.9
  Bottom 0.3: v73.9,9.65 73.5,9.25 P45.P$1
GP11/SPI_MOSI/LCD_SDI/TP_SDI/SD_SDI  (via drill 0.3)
  Top 0.2: 58.29,26 R24.1 | v53.78,25.95 53.78,26 J17.13 47.55,26 | v71.05,25.93 70.97,26.01 70.97,26.93 70.01,27.89 U1.14 | U3.14 33.63,22.55 34.34,23.26 34.34,27.46 35.86,28.98 43.89,28.98 47.08,25.8 v47.24,25.8
  Top 0.203: 47.55,26 47.34,25.8 v47.24,25.8
  Top 0.3: SD1.3 76.07,9.98 v76.2,9.85
  Top 0.305: SD1.3 76.07,18.66 v75.89,18.84 75.6,19.13 R39.2 | R24.1 58.34,25.34 v58.31,25.32
  Bottom 0.2: v53.78,25.95 54.6,25.95 55.4,25.15 58.32,25.15 | 58.32,25.15 67.4,25.15 68.81,26.56 70.12,26.56 70.75,25.93 v71.05,25.93 74.44,25.93 75.96,24.41 75.96,18.91 v75.89,18.84 | v58.31,25.32 58.32,25.31 58.32,25.15
  Bottom 0.203: v47.24,25.8 47.2,25.8 P44.P$1
  Bottom 0.3: v76.2,9.85 76.2,9.15 P36.P$1
GP12/SPI_MISO/LCD_SDO/TP_SDO/SD_SDO  (via drill 0.3, 0.35)
  Top 0.2: v71.5,24.53 71.67,24.7 71.67,30.75 71.45,30.97 U1.15 | 71.41,19.57 R40.2 | U3.12 v33.41,23.82 | v34.02,20.98 38.14,16.86 41.5,16.86 v41.88,16.48
  Top 0.3: SD1.7 71.67,11.68 v71.7,11.65
  Top 0.305: SD1.7 71.67,18.73 v71.53,18.87 71.53,19.46 71.41,19.57
  Bottom 0.2: v71.5,24.53 71.5,18.9 v71.53,18.87 71.56,18.84 71.56,16.28 69.61,14.33 43.26,14.33 41.94,15.65 41.94,16.42 v41.88,16.48 | v33.41,23.82 33.41,21.59 v34.02,20.98
  Bottom 0.3: v71.7,11.65 71.7,10.95 P46.P$1
GP14/BUZZER  (via drill 0.3)
  Top 0.2: U1.17 71.58,31.77 v71.8,31.55 | v72.9,30.75 72.7,30.55 72.7,27.65 73.3,27.05 81.86,27.05 v82.47,27.66 | v89.03,27.75 88.5,27.75 Q2.1
  Top 0.305: Q2.1 88.56,27.81 R14.2
  Bottom 0.2: v71.8,31.55 72.5,31.55 72.9,31.15 v72.9,30.75 | v82.47,27.66 88.94,27.66 v89.03,27.75
GP15/LCD_RST  (via drill 0.3)
  Top 0.2: v69.54,23.76 71.93,23.76 72.17,24 72.17,31.02 72.5,31.35 72.5,31.75 72.08,32.17 U1.18 | v50.2,27 J17.15
  Bottom 0.2: v69.54,23.76 69.04,23.76 68.54,23.26 52.06,23.26 50.2,25.12 v50.2,27
  Bottom 0.305: P5.P$1 50.15,27.05 v50.2,27
GP16/TP_CS/SPI_CS1  (via drill 0.3)
  Top 0.2: v72.78,37.05 71.5,35.77 U1.27
  Top 0.203: U3.15 30.88,21.91 30.73,21.77 30.73,20.84 30.98,20.59 33.35,20.59 37.75,16.19 v41.13,16.19 v41.14,16.18
  Bottom 0.2: 79.17,16.6 79.17,33.62 75.98,36.81 73.02,36.81 v72.78,37.05
  Bottom 0.203: 79.17,16.6 76.31,13.74 43.09,13.74 41.14,15.69 v41.14,16.18
GP17/TP_IRQ  (via drill 0.3)
  Top 0.2: R105.1 72.34,38.45 70.85,36.96 v70.85,36.8 U1.28 | U3.11 33.35,24.45 33.87,24.97 33.87,32.32 36.24,34.69 v36.24,35.36
  Bottom 0.2: v36.24,35.36 36.24,36.76 36.59,37.11 70.54,37.11 v70.85,36.8
GP18/LCD_BL_PWM  (via drill 0.3)
  Top 0.2: U1.29 70.01,38.45 v70.24,38.68 | Q1.1 35.94,40.04 v38.01,40.04
  Top 0.508: Q1.1 35.88,41.67 R8.2
  Bottom 0.2: v38.01,40.04 39,39.05 69.87,39.05 v70.24,38.68
GP19*  (via drill 0.35)
  Top 0.2: U1.30 69.61,38.89 70.35,39.63 70.35,51.28 69.64,51.99 64.86,51.99 v64.12,51.25
  Top 0.254: J2.9 v64.12,51.25
  Bottom 0.254: P53.P$1 64.19,52.62 64.12,52.55 v64.12,51.25
GP20/I2C0_SDA  (via drill 0.3, 0.35)
  Top 0.2: U1.31 69.21,39.2 69.82,39.81 v69.82,42.86 69.82,45.83 v69.79,45.86 | 49.39,12.5 v49.39,12.96 | J2.10 v66.66,46.32
  Top 0.254: J2.10 66.66,51.25 v66.7,51.25
  Top 0.3: J6.2 48.75,7.8 v48.7,7.75
  Top 0.305: J6.2 48.75,10.33 49.39,10.97 v49.39,12.96 | R3.1 49.39,12.5
  Bottom 0.2: v69.79,45.86 69.65,46 66.98,46 v66.66,46.32 | 49.42,12.93 v49.39,12.96 50.15,12.96 50.41,13.22 76.52,13.22 79.7,16.4 79.7,39.3 76.02,42.98 69.94,42.98 v69.82,42.86
  Bottom 0.254: v66.7,51.25 v66.71,51.26 P54.P$1
  Bottom 0.3: v48.7,7.75 P15.P$1
GP21/I2C0_SCL  (via drill 0.3, 0.35)
  Top 0.2: U1.32 68.81,39.55 69.19,39.93 69.19,42.95 69.19,43.3 69.19,43.43 69.2,43.44 | 50.76,13.04 50.75,13.05 | v69.22,43.4 69.24,43.4 69.2,43.44 | J2.11 69.2,43.44
  Top 0.254: J2.11 v69.2,51.25
  Top 0.3: v50.8,7.75 50.8,8.35 50.9,8.45 50.9,9.25 J6.1
  Top 0.305: J6.1 v50.76,12.51 50.76,13.04 | 50.75,13.05 50.75,13.79 R26.1
  Bottom 0.2: v50.76,12.51 50.93,12.68 76.74,12.68 80.31,16.25 80.31,39.47 76.29,43.49 69.31,43.49 v69.22,43.4
  Bottom 0.254: P55.P$1 69.2,52.66 v69.2,51.25
  Bottom 0.3: P16.P$1 v50.8,7.75
GP22/SD_CS/SPI_CS2  (via drill 0.3)
  Top 0.2: U1.34 68.01,37.78 v67.79,38
  Top 0.3: SD1.2 77.17,11.68 v77.2,11.65
  Top 0.305: 77.07,18.84 77.07,15.15 SD1.2
  Top 0.406: 77.07,18.84 77.07,19.62 R36.2 77.17,19.52 v77.17,18.94
  Bottom 0.2: v67.79,38 67.98,37.81 70.76,37.81 72.25,36.32 75.68,36.32
  Bottom 0.203: v77.17,18.94 78.55,20.32 78.55,33.45 75.68,36.32
  Bottom 0.3: v77.2,11.65 77.2,10.95 P47.P$1
GP26*ADC0*I2C1_SDA  (via drill 0.3, 0.35)
  Top 0.2: U1.38 66.41,42.7 67.36,43.65 v67.36,45.21 | J2.12 71.62,49.01 71.62,45.38 v71.59,45.35
  Top 0.254: J2.12 71.74,51.19 v71.8,51.25
  Bottom 0.2: v67.36,45.21 71.45,45.21 v71.59,45.35
  Bottom 0.254: v71.8,51.25 P56.P$1
GP27*ADC1*I2C1_SCL  (via drill 0.3, 0.35)
  Top 0.2: U1.39 66.01,43.09 66.69,43.77 v66.69,44.62 | J2.13 74.28,45.48 v74.24,45.44
  Top 0.254: J2.13 74.28,51.23 v74.3,51.25
  Bottom 0.2: v66.69,44.62 73.53,44.62 74.24,45.33 v74.24,45.44
  Bottom 0.254: P57.P$1 v74.3,51.25
GP28*ADC2  (via drill 0.3, 0.35)
  Top 0.2: U1.40 65.61,43.67 v66,44.06 | 76.84,49.1 v76.84,45.28 76.84,49.11 J2.14
  Top 0.254: J2.14 76.82,51.23 v76.8,51.25
  Bottom 0.2: v66,44.06 75.62,44.06 v76.84,45.28
  Bottom 0.254: P58.P$1 76.8,52.66 v76.8,51.25
GP29/BAT+_ADC3  (via drill 0.3)
  Top 0.2: U1.41 65.21,37.68 64.89,38 v64.8,38 | v63.35,38.02 63.04,38.33 59.86,38.33
  Top 0.3: R19.1 59.86,38.33 R20.2
  Bottom 0.2: v64.8,38 63.37,38 v63.35,38.02
IM0  (via drill 0.35)
  Top 0.254: J17.38 48.35,38.5 46.38,36.53 R15.1
  Top 0.3: R15.1 R16.2
  Top 0.305: 43.6,35.23 R16.2 43.58,35.23 v43.6,35.25
  Bottom 0.305: P60.P$1 v43.6,35.25
IM1  (via drill 0.35)
  Top 0.254: J17.39 42.78,39 42.67,38.89
  Top 0.3: R18.2 42.67,38.89 R17.1
  Top 0.305: R18.2 43.7,37.83 | R18.2 43.68,37.83 v43.7,37.85 | R18.2 43.58,37.83 43.6,37.85
  Bottom 0.305: P61.P$1 44.4,37.85 v43.7,37.85
IM2  (via drill 0.35)
  Top 0.254: J17.40 43.7,39.5 42.77,40.43 R22.2
  Top 0.3: R22.2 R21.1
  Top 0.305: R21.1 43.58,41.73 v43.6,41.75
  Bottom 0.305: v43.6,41.75 P62.P$1
LED-A  (via drill 0.35)
  Top 0.305: J17.33 50.95,36 50.49,35.54
  Top 0.406: 50.49,35.54 47.35,35.54 43.46,31.65 R27.1
  Top 0.508: v43.5,31.65 R27.1
  Bottom 0.508: v43.5,31.65 P40.P$1
LED-K  (via drill 0.3)
  Top 0.3: J17.34 50.13,36.5 | J17.35 51.04,37 50.86,37 | J17.36 51.03,37.5 50.88,37.5
  Top 0.305: 51.03,37.5 50.15,37.5 50.13,37.52 | 51.04,37 50.14,37 50.13,36.99
  Top 0.406: v50.13,36.28 50.13,36.5 50.13,36.99 50.13,37.52 | v37.98,36.46 35.95,36.46 R9.2
  Bottom 0.3: v37.98,36.46 v37.99,36.45 P41.P$1
  Bottom 0.406: v50.13,36.28 50.05,36.36 38.08,36.36 v37.98,36.46
N$1
  Top 0.2: C2.2 R2.1 74.53,32.18 X1.3
N$2
  Top 0.2: R2.2 74.2,33.37 U1.21
N$3
  Top 0.2: C1.1 76.14,29.71 X1.1 76.23,30.02 75.34,30.91 73.83,30.91 73.54,31.2 73.54,32.63 73.2,32.97 U1.20
N$4
  Top 0.406: D1.- 89.7,19.6 89.29,19.19 87.91,19.19 | 87.91,19.19 87.82,19.19 87.82,17.78 87.46,17.42 82.27,17.42 81.7,17.99 R4.1 | 87.91,19.19 B1.1
N$5
  Top 0.254: R68.1 21.18,48.17 J15.B5
N$6
  Top 0.406: Q2.3 87.85,25.75 B1.2 88.88,23.25 89.7,22.43 D1.+
N$7
  Top 0.508: R9.1 34.34,37.19 Q1.3
N$9
  Top 0.508: U5.5 20.16,38.98 21.34,37.8 R84.1
N$10
  Top 0.813: L4.1 19.97,21.54 U6.3
N$14
  Top 0.254: R13.2 13.11,16.55 12.17,17.49 J14.A5
N$15
  Top 0.508: R85.1 D15.+
N$16
  Top 0.254: J15.A5 24.18,48.21 R69.2
N$19
  Top 0.254: R12.1 11.31,12.35 9.17,14.49 J14.B5
N$20
  Top 0.3: U3.7 38.77,25.09 40.47,26.79 R23.2
N$22
  Top 0.305: SD1.1 78.27,19.72 R37.2
N$24
  Top 0.305: SD1.8 70.57,18.93 69.9,19.6 R38.2
N$28
  Top 0.3: U7.9 29.44,44.05 R70.1
N$31
  Top 0.3: U7.8 30.04,43.55 R83.1
N$35
  Top 0.508: D3.+ R35.1
N$43
  Top 0.254: U6.5 22.37,24.08 22.53,24.08 R82.2 R81.2
QSPI_CS  (via drill 0.3)
  Top 0.2: U1.56 63.16,30.97 62.92,30.73 62.92,21.95 v63.08,21.79 | R7.1 v58.35,21.79 58.15,21.59 U2.1 | v70.58,22.23 70.69,22.12 72.35,22.12 74.99,24.76 80.93,24.76 R6.1
  Top 0.508: 58.25,23.71 R7.1
  Bottom 0.2: v58.35,21.79 v63.08,21.79 70.14,21.79 v70.58,22.23
QSPI_D0
  Top 0.2: U1.53 62.41,32.17 61.58,31.34 61.58,21 61.76,20.82 61.76,19.4 63.4,17.76 64.73,17.76 U2.5
QSPI_D1  (via drill 0.3)
  Top 0.2: U1.55 62.88,31.37 62.49,30.98 62.49,21.43 62.9,21.02 v62.9,20.97 | v57.75,20.28 56.69,20.28 U2.2
  Bottom 0.2: v62.9,20.97 60.41,20.97 59.72,20.28 v57.75,20.28
QSPI_D2  (via drill 0.3)
  Top 0.2: U1.54 62.66,31.77 62.05,31.15 62.05,21.19 62.26,20.98 62.26,19.81 v62.39,19.68 | U2.3 v57.7,19.04 v57.71,19.05
  Bottom 0.2: v62.39,19.68 61,19.68 60.37,19.05 v57.71,19.05
QSPI_D3  (via drill 0.3)
  Top 0.2: U1.51 61.94,32.97 60.66,31.69 v60.66,20.31 | 64.55,20.52 U2.7 64.73,20.3 v63.65,20.3
  Bottom 0.2: v63.65,20.3 v60.67,20.3 v60.66,20.31
QSPI_SCK  (via drill 0.3)
  Top 0.2: U1.52 62.2,32.57 61.12,31.49 61.12,20.8 61.29,20.63 v61.29,19.03 | U2.6 64.72,19.02 v63.64,19.02
  Bottom 0.2: v63.64,19.02 v61.3,19.02 v61.29,19.03
RESET  (via drill 0.3)
  Top 0.2: U1.26 71.99,35.37 74.16,37.54 78.21,37.54 81.6,34.15 v82.3,34.15 | C4.1 88.24,34.79 v87.73,34.28
  Top 0.305: C4.1 R1.1 91.16,37.01 92,37.85 SW1.2 92.01,40.56
  Bottom 0.2: v82.3,34.15 85.8,34.15 | 85.8,34.15 87.6,34.15 v87.73,34.28 | P31.P$1 85.8,33.44 85.8,34.15
SWCLK  (via drill 0.3)
  Top 0.2: U1.24 72.95,34.57 v73.2,34.82
  Bottom 0.2: v73.2,34.82 73.82,34.82 P11.P$1
SWDIO  (via drill 0.3)
  Top 0.2: U1.25 72.47,34.97 v73.18,35.68
  Bottom 0.2: v73.18,35.68 72.89,35.39 P12.P$1
TP_X+  (via drill 0.3)
  Top 0.254: J17.1 44.03,20 v44,20.03 | v41.61,21.26 41.42,21.26 C30.2
  Top 0.3: U3.2 40.76,21.91 C30.2
  Bottom 0.254: v41.61,21.26 v41.62,21.26 41.74,21.14 42.89,21.14 v44,20.03 44.5,19.53 P33.P$1
TP_X-  (via drill 0.3)
  Top 0.254: J17.3 45.48,21 44.69,21.79 v44.69,23.26 | v41.48,23.86 41.42,23.86 C39.2
  Top 0.3: U3.4 38.95,23.18 39.96,24.2 41.08,24.2 C39.2
  Bottom 0.254: v41.48,23.86 42.08,23.26 v44.69,23.26 45.01,23.26 P38.P$1
TP_Y+  (via drill 0.3)
  Top 0.254: J17.4 45.97,21.5 v45.34,22.13 | v41.55,22.53 41.45,22.53 C38.2
  Top 0.3: U3.3 39.32,22.55 39.72,22.95 41.03,22.95 C38.2
  Bottom 0.254: v41.55,22.53 41.95,22.13 v45.34,22.13 45.36,22.11 P39.P$1
TP_Y-  (via drill 0.3)
  Top 0.254: J17.2 45.15,20.5 44.04,21.61 v44.04,24.28 | v41.61,25.11 41.46,25.11 C40.2
  Top 0.3: U3.5 38.65,23.82 40.32,25.49 C40.2
  Bottom 0.254: v41.61,25.11 42.44,24.28 v44.04,24.28 44.06,24.3 P37.P$1
UART_USB_D+  (via drill 0.3)
  Top 0.254: U7.1 22.75,49.05 | 22.75,49.05 22.75,49.44 22.18,50.01 J15.B6 22.18,52.55 22.33,52.7 23.02,52.7 23.18,52.54 J15.A6 | v22.6,49.05 22.75,49.05
  Bottom 0.254: P27.P$1 v22.6,49.05
UART_USB_D-  (via drill 0.3)
  Top 0.254: J15.A7 22.68,50.29 22.93,50.04 23.27,50.04 | U7.2 23.58,44.05 23.77,44.24 23.77,44.82 23.26,45.33 23.26,49.05 | J15.B7 23.68,50.28 23.44,50.04 23.27,50.04 | 23.27,50.04 23.26,50.03 23.26,49.05 | v23.41,49.05 23.26,49.05
  Bottom 0.254: P28.P$1 v23.41,49.05
USB_D+  (via drill 0.3)
  Top 0.203: U1.47 62.09,34.57 v61.89,34.37 | v15.56,13.76 v15.55,13.75 R11.2
  Bottom 0.203: v61.89,34.37 61.89,34.17 61.31,33.59 39.67,33.59 37.78,31.7 37.78,16.25 35.77,14.24 16.7,14.24 | 16.7,14.24 16.11,14.24 15.63,13.76 v15.56,13.76 | P3.P$1 16.7,14.24
USB_D-  (via drill 0.3)
  Top 0.203: U1.46 61.47,34.97 v61.28,34.78 | v15.53,15.14 14.67,15.14 R10.2
  Bottom 0.203: v61.28,34.78 61.28,34.48 60.84,34.04 39.48,34.04 37.31,31.87 37.31,16.47 35.54,14.7 16.7,14.7 | v15.53,15.14 15.73,15.14 16.17,14.7 16.7,14.7 | P4.P$1 16.7,14.7
VBAT_IN  (via drill 0.3)
  Top 0.305: 7.5,27.61 R66.2 7.34,27.85 7.34,29.31 Q19.1 7.1,29.55 7.1,34.25 v9.4,36.55
  Top 0.508: 18,35.95 C22.2 17.8,35.65 D5.2 16.27,35.62 16.32,35.67 v16.32,36.47 16.32,37.17 D4.2 16.5,37.25 | 18,35.95 18,36.35 | 18,36.35 18,37.12 C23.1 17.1,38.08 U5.4 | 17.88,36.07 18,35.95 | 17.9,36.25 18,36.35
  Bottom 0.305: v16.32,36.47 16.24,36.55 v9.4,36.55
VIN  (via drill 0.5, 0.55)
  Top 0.508: D2.- 10.5,29.55 v10.5,28.75 10.5,29.35 Q19.2
  Top 0.813: U6.4 22.37,22.46 20.61,24.22 U6.1 19.94,24.25 17.04,24.25 | 17.04,24.25 D8.2 17.04,26.01 v17,26.05 | 17.04,24.25 17.04,23.09 C31.2 17.07,21.27 | C32.1 17.07,21.27 | 17.07,21.27 17.07,19.68 D6.2
  Bottom 0.813: v10.5,28.75 10.5,33.45 11.3,34.25 16.2,34.25 17,33.45 v17,26.05
(copper drawn outside any net)
  shapes: Top area x2

## Text on the board
tPlace: J2 | TX0_GP0 | RX0_GP1 | GND | 3.3V | + | GP | 0 | 1 | 2 | 3 | 4 | 5 | 6 | 7 | 19 | 20 | 21 | 26 | 27 | 28 | - | D4 | D5 | V1.0 | D6 | D6 | D8 | D8 | Pico Display-3.5 Inch | SKU:DIS01135P | GND | 3.3V | SDA_GP20 | SCL_GP21 | GND | 3.3V | TX1_GP4 | RX1_GP5
bPlace: GND | GND | 3.3V | +5V_2 | D+ | D- | BAT+ | GND | GND | +5V_1 | D- | 3.3V | GND | D+ | GND | GND | GND | 3.3V | 3.3V | GND